# Altium schematic sheet Power_supply_and_regulators.SchDoc
size A4; SheetNumber: 17; SheetTotal: 19
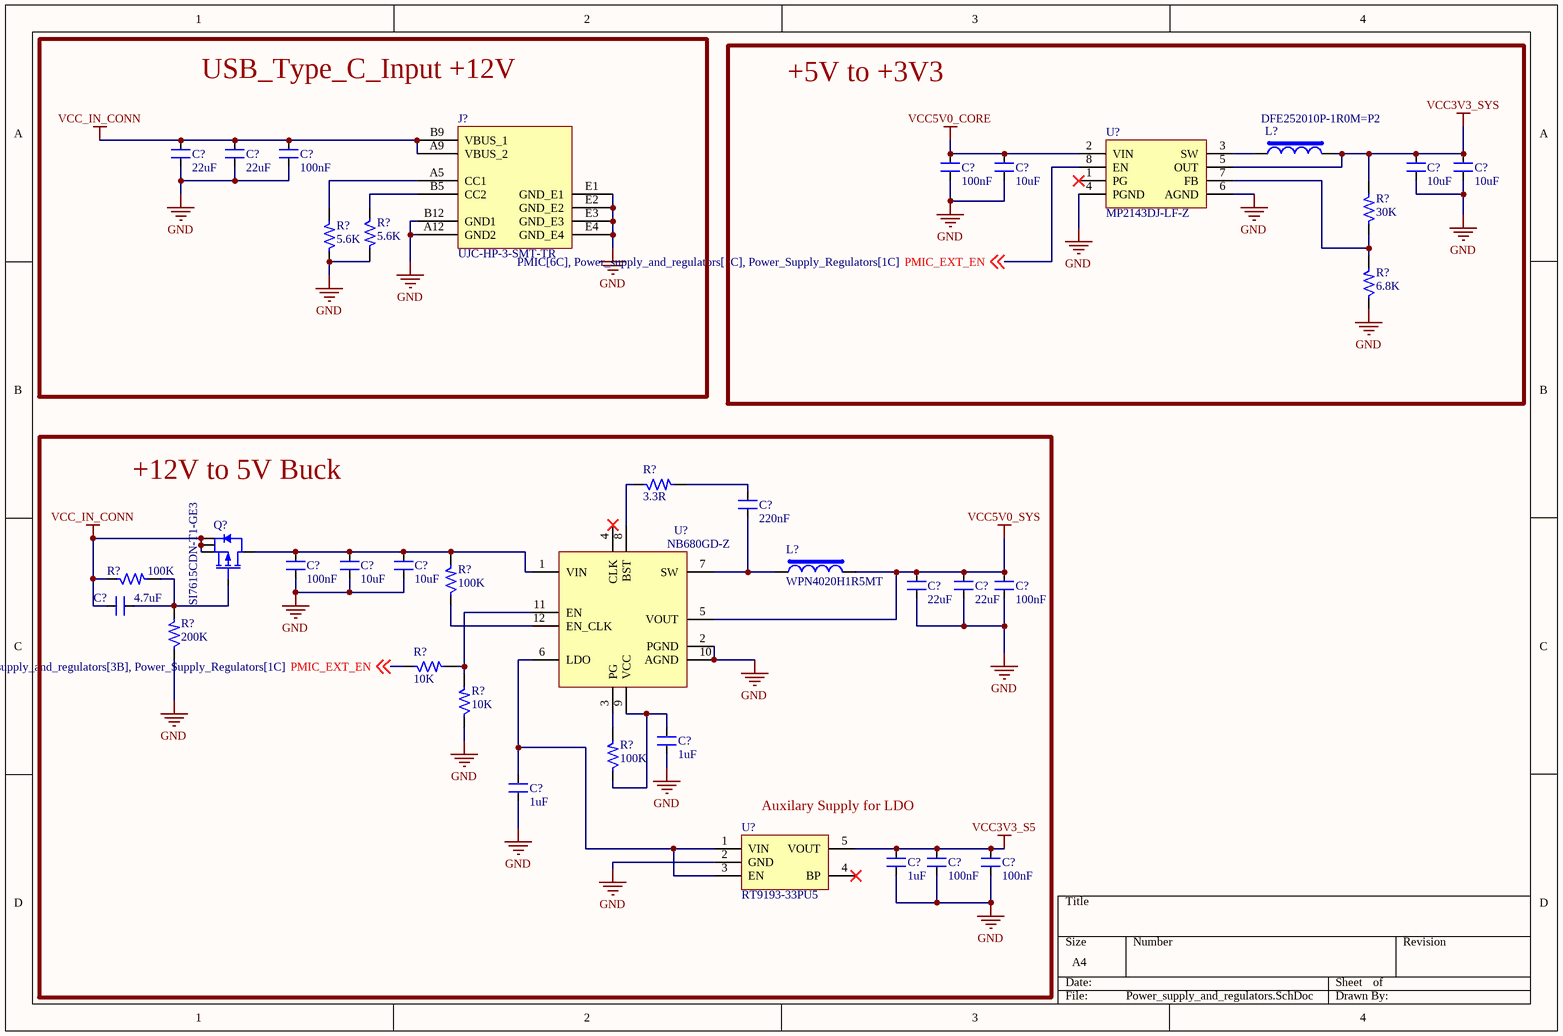
[diagram p0: Power_supply_and_regulators.SchDoc]

## Parts
(Parts that share a designator on the sheet are numbered #1, #2 ... from top to bottom, then left to right.)
C?#1  22uF  [CAP_0603]
C?#2  22uF  [CAP_0603]
C?#3  100nF  [CAP_0402]
C?#4  100nF  [CAP_0402]
C?#5  10uF  [CAP_0402]
C?#6  10uF  [CAP_0402]
C?#7  10uF  [CAP_0402]
C?#8  220nF  [CAP_0402]
C?#9  100nF  [CAP_0402]
C?#10  10uF  [CAP_0402]
C?#11  10uF  [CAP_0402]
C?#12  22uF  [CAP_0603]
C?#13  22uF  [CAP_0603]
C?#14  100nF  [CAP_0402]
C?#15  4.7uF  [CAP_0402]
C?#16  1uF  [CAP_0402]
C?#17  1uF  [CAP_0402]
C?#18  1uF  [CAP_0402]
C?#19  100nF  [CAP_0402]
C?#20  100nF  [CAP_0402]
J?  UJC-HP-3-SMT-TR  [CON6_48.4_UJC-HP-3-SMT-TR]
L?#1  DFE252010P-1R0M=P2  [IND_1008]
L?#2  WPN4020H1R5MT  [IND_1616]
Q?  SI7615CDN-T1-GE3  [PowerPAK_1212-8_SMD]
R?#1  5.6K  [RES_0402]
R?#2  30K  [RES_0402]
R?#3  5.6K  [RES_0402]
R?#4  6.8K  [RES_0402]
R?#5  3.3R  [RES_0402]
R?#6  100K  [RES_0402]
R?#7  100K  [RES_0402]
R?#8  200K  [RES_0402]
R?#9  10K  [RES_0402]
R?#10  10K  [RES_0402]
R?#11  100K  [RES_0402]
U?#1  MP2143DJ-LF-Z  [SOT23-8]
U?#2  NB680GD-Z  [QFN-12_19_118X118_SMD]
U?#3  RT9193-33PU5  [SC70-5]

## Blocks framed on the sheet
USB_Type_C_Input +12V: C?#1-C?#3 J? R?#1 R?#3
+5V to +3V3: C?#4-C?#7 L?#1 R?#2 R?#4 U?#1
+12V to 5V Buck: C?#8-C?#20 L?#2 Q? R?#5-R?#11 U?#2 U?#3

## Nets
GND: C?#1.1 C?#2.1 C?#3.1 C?#4.1 C?#5.1 C?#6.1 C?#7.1 C?#9.1 C?#10.1 C?#11.1 C?#12.1 C?#13.1 C?#14.1 C?#16.1 C?#17.1 C?#18.1 C?#19.1 C?#20.1 J?.A12(GND2) J?.B12(GND1) J?.E1(GND_E1) J?.E2(GND_E2) J?.E3(GND_E3) J?.E4(GND_E4) R?#1.2 R?#3.1 R?#4.1 R?#8.1 R?#10.1 U?#1.4(PGND) U?#1.6(AGND) U?#2.2(PGND) U?#2.10(AGND) U?#3.2(GND)
VCC3V3_S5: C?#18.2 C?#19.2 C?#20.2 U?#3.5(VOUT)
VCC3V3_SYS: C?#6.2 C?#7.2 L?#1.2 R?#2.2 U?#1.5(OUT)
VCC5V0_CORE: C?#4.2 C?#5.2 U?#1.2(VIN)
VCC5V0_SYS: C?#12.2 C?#13.2 C?#14.2 L?#2.2 U?#2.5(VOUT)
VCC_IN_CONN: C?#1.2 C?#2.2 C?#3.2 C?#15.1 J?.A9(VBUS_2) J?.B9(VBUS_1) Q?.1(S) Q?.2(S) Q?.3(S) R?#6.1
PMIC_EXT_EN: R?#9.1 U?#1.8(EN) ; off-sheet PMIC_EXT_EN
NetC?#8_1: C?#8.1 L?#2.1 U?#2.7(SW)
NetC?#8_2: C?#8.2 R?#5.2
NetC?#9_2: C?#9.2 C?#10.2 C?#11.2 Q?.5(D) R?#7.2 U?#2.1(VIN)
NetC?#15_2: C?#15.2 Q?.4(G) R?#6.2 R?#8.2
NetC?#16_2: C?#16.2 R?#11.1 U?#2.9(VCC)
NetC?#17_2: C?#17.2 U?#2.6(LDO) U?#3.1(VIN) U?#3.3(EN)
NetJ?_A5: J?.A5(CC1) R?#3.2
NetJ?_B5: J?.B5(CC2) R?#1.1
NetL?#1_1: L?#1.1 U?#1.3(SW)
NetR?#2_1: R?#2.1 R?#4.2 U?#1.7(FB)
NetR?#5_1: R?#5.1 U?#2.8(BST)
NetR?#7_1: R?#7.1 U?#2.12(EN_CLK)
NetR?#9_2: R?#9.2 R?#10.2 U?#2.11(EN)
NetR?#11_2: R?#11.2 U?#2.3(PG)

Not connected (* = marked no-connect by the designer): U?#1 1(PG)*; U?#2 4(CLK)*; U?#3 4(BP)*

## Notes on the sheet
- Auxilary Supply for LDO

## Library data of the parts
C?#1 C?#2 C?#12 C?#13 = CAP_22uF-10V-20%-0603: 22µF ±20% 10V Ceramic Capacitor X5R 0603 (1608 Metric); Manufacturer: Murata Electronics; Manufacturer Part Number: GRM188R61A226ME15D; Case/Package: 0603; Supplier-1: Digikey
C?#3 C?#4 C?#9 C?#14 C?#19 C?#20 = CAP_100nF-25V-10%-0402: 0.1µF ±10% 25V Ceramic Capacitor X7R 0402 (1005 Metric); Manufacturer: Walsin Technology Corporation; Manufacturer Part Number: 0402B104K250CT; Case/Package: 0402; Supplier-1: Digikey
C?#5-C?#7 C?#10 C?#11 = CAP_10uF-10V-20%-0402: 10µF ±20% 10V Ceramic Capacitor X5R 0402 (1005 Metric); Manufacturer Part Number: CL05A106MP5NUNC; Manufacturer: Samsung Electro-Mechanics; Case/Package: 0402; Supplier-1: Digikey
C?#8 = CAP_220nF-10V-10%-0402: 0.22µF ±10% 10V Ceramic Capacitor X7R 0402 (1005 Metric); Manufacturer: Samsung Electro-Mechanics; Manufacturer Part Number: CL05B224KP5NNNC; Case/Package: 0402; Supplier-1: Digikey
C?#15 = CAP_4.7uF-10V-10%-0402: 4.7µF ±10% 10V Ceramic Capacitor X5R 0402 (1005 Metric); Manufacturer: Samsung Electro-Mechanics; Manufacturer Part Number: CL05A475KP5NRNC; Case/Package: 0402; Supplier-1: Digikey
C?#16-C?#18 = CAP_1uF-16V-10%-0402: 1µF ±10% 16V Ceramic Capacitor X5R 0402 (1005 Metric); Manufacturer: Knowles Novacap; Manufacturer Part Number: 0402BW105K160YT; Case/Package: 0402; Supplier-1: Digikey
J? = CON-TYPEC_6X1-100-RA-TH: USB Connectors USB jack, C type, power only, 6 pin, horizonal, gold flash plating, surface mount, T&R; Manufacturer: CUI Devices; Manufacturer Part Number: UJC-HP-3-SMT-TR; Case/Package: TH; Supplier-1: Mouser
L?#1 = IND_1uH-3.8A-20%-1008: 1µH Shielded Wirewound Inductor 3.8A 54mOhm Max 1008 (2520 Metric); Manufacturer: Murata Electronics; Manufacturer Part Number: DFE252010P-1R0M=P2; Case/Package: 1008; Supplier-1: Digikey
L?#2 = IND_1.5uH-6A-20%-SMD: Wire Wound SMD Power Inductors – WPN Series / Operating Temp. : -40℃~+125℃ (Including self-heating); Manufacturer: Sunlord; Mnaufcaturer Part Number: WPN4020H1R5MT; Case/Package: SMD; Supplier-1: NA
Q? = MOSFET-P_20V-35A-1212-8: P-Channel 20V 35A (Tc) 33W (Tc) Surface Mount PowerPAK® 1212-8; Manufacturer: Vishay Siliconix; Manufacturer Part Number: SI7615CDN-T1-GE3; Case/Package: PowerPAK® 1212-8; Supplier-1: Digikey
R?#1 R?#3 = RES_5.6K-0.1W-1%-0402: 5.6 kOhms ±1% 0.1W, 1/10W Chip Resistor 0402 (1005 Metric) Automotive AEC-Q200, Moisture Resistant Thick Film; Manufacturer: KOA Speer Electronics, Inc.; Manufacturer Part Number: RK73H1ETTP5601F; Case/Package: 0402; Supplier-1: Digikey
R?#2 = RES_30K-0.1W-1%-0402: 30 kOhms ±1% 0.1W, 1/10W Chip Resistor 0402 (1005 Metric) Automotive AEC-Q200, Moisture Resistant Thick Film; Manufacturer: KOA Speer Electronics, Inc.; Manufacturer Part Number: RK73H1ETTP3002F; Case/Package: 0402; Supplier-1: Digikey
R?#4 = RES_6.8K-0.1W-1%-0402: 6.8 kOhms ±1% 0.1W, 1/10W Chip Resistor 0402 (1005 Metric) Anti-Sulfur Thin Film; Manufacturer: Vishay Beyschlag/Draloric/BC Components; Manufacturer Part Number: MCS04020C6801FE000; Supplier-1: Digikey; Case/Package: 0402
R?#5 = RES_3.3R-0.1W-1%-0402: 3.3 Ohms ±1% 0.1W, 1/10W Chip Resistor 0402 (1005 Metric) Anti-Sulfur, Automotive AEC-Q200 Thick Film; Manufacturer: Panasonic Electronic Components; Manufacturer Part Number: ERJ-U02F3R30X; Case/Package: 0402; Supplier-1: Digikey
R?#6 R?#7 R?#11 = RES_100K-0.1W-1%-0402: 100 kOhms ±1% 0.1W, 1/10W Chip Resistor 0402 (1005 Metric) Anti-Sulfur Thin Film; Manufacturer: Vishay Beyschlag/Draloric/BC Components; Manufacturer Part Number: MCS04020C1003FE000; Case/Package: 0402; Supplier-1: Digikey
R?#8 = RES_200K-0.1W-1%-0402: 200 kOhms ±1% 0.1W, 1/10W Chip Resistor 0402 (1005 Metric) Automotive AEC-Q200 Thick Film; Manufacturer: Panasonic Electronic Components; Manufacturer Part number: ERJ-2RKF2003X; Case/Package: 0402; Supplier-1: Digikey
R?#9 R?#10 = RES_10K-0.1W-1%-0402: 10 kOhms ±1% 0.1W, 1/10W Chip Resistor 0402 (1005 Metric) Anti-Sulfur Thin Film; Manufacturer: Vishay Beyschlag/Draloric/BC Components; Manufacturer Part Number: MCS04020C1002FE000; Case/Package: 0402; Supplier-1: Digikey
U?#1 = REG_0.6~5V-5.5V-3A-TSOT-23-8: Switching Voltage Regulators 3A, 5.5V, 1.2MHz Sync Stp-Dwn Swtchr; Manufacturer: Monolithic Power Systems (MPS); Manufacturer Part Number: MP2143DJ-LF-Z; Case/Package: TSOT-23-8; Supplier-1: Mouser
U?#2 = REG_3.3V-26V-8A-QFN-12: Switching Voltage Regulators 26V Fixed 3.3 V-8A Sync Buck Converter; Manufacturer: Monolithic Power Systems (MPS); Manufacturer Part Number: NB680GD-Z; Case/Package: QFN-12; Supplier-1: Mouser
U?#3 = REG_3.3V-5.5V-300mA-SC-70-5: SC-70-5 Dropout Regulators(LDO) RoHS; Manufacturer: Richtek Tech; Manufacturer Part Number: RT9193-33PU5; Case/Package: SC-70-5; Supplier-1: LCSC